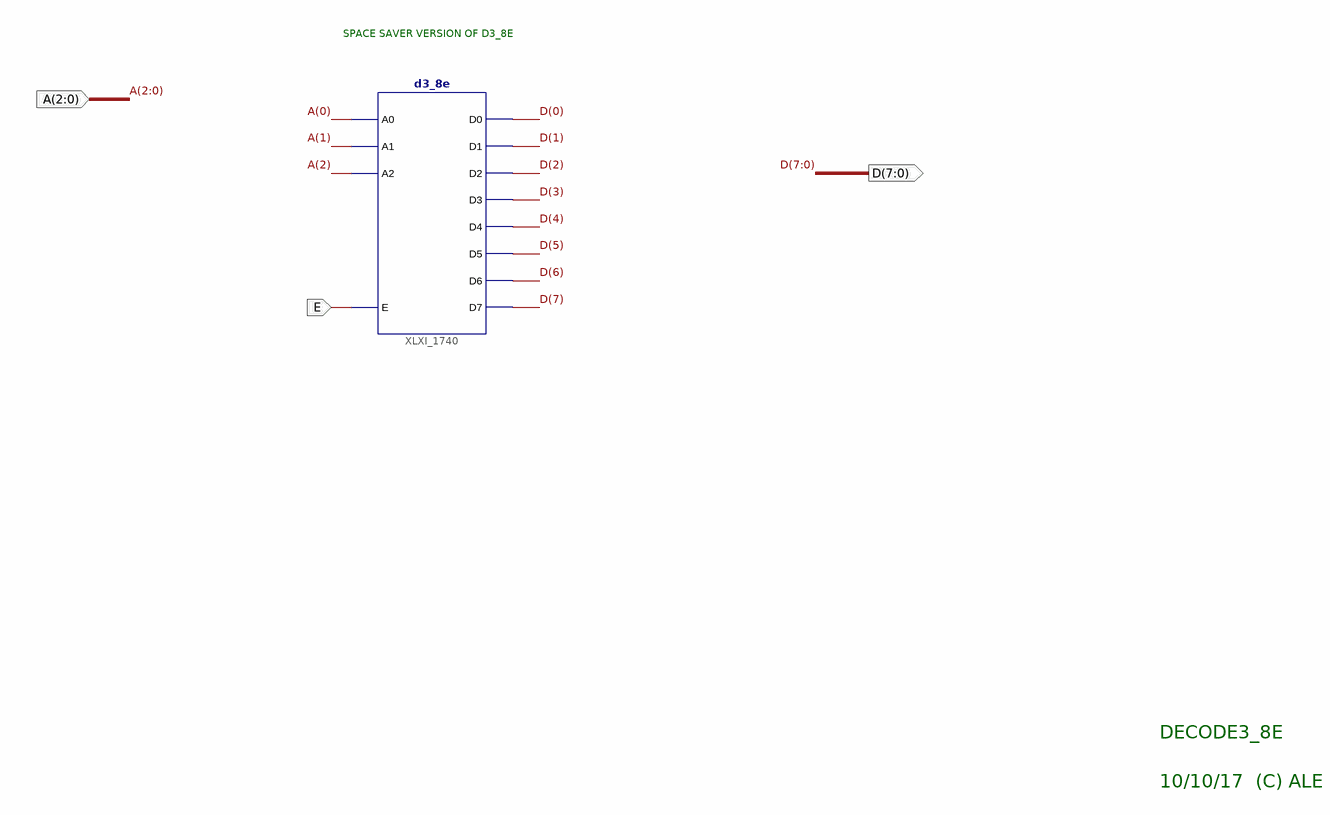
[diagram p0: schematic sheet 1]
// Xilinx ISE schematic Decode3_8E.sch (zynq) as structural Verilog: 1 symbols, 3 ports
module Decode3_8E (
  input  E,
  input  [2:0] A,
  output [7:0] D
);

  d3_8e XLXI_1740 (
    .A0(A[0]), .A1(A[1]), .A2(A[2]), .E(E), .D0(D[0]), .D1(D[1]), .D2(D[2]), .D3(D[3]), .D4(D[4]), .D5(D[5]),
    .D6(D[6]), .D7(D[7]));

  // Notes on the sheet:
  //   SPACE SAVER VERSION OF D3_8E
  //   DECODE3_8E
  //   10/10/17  (C) ALE
endmodule
